# Altium schematic sheet DEVICE-DESKTOP-910Q0FJ.SchDoc
size A4
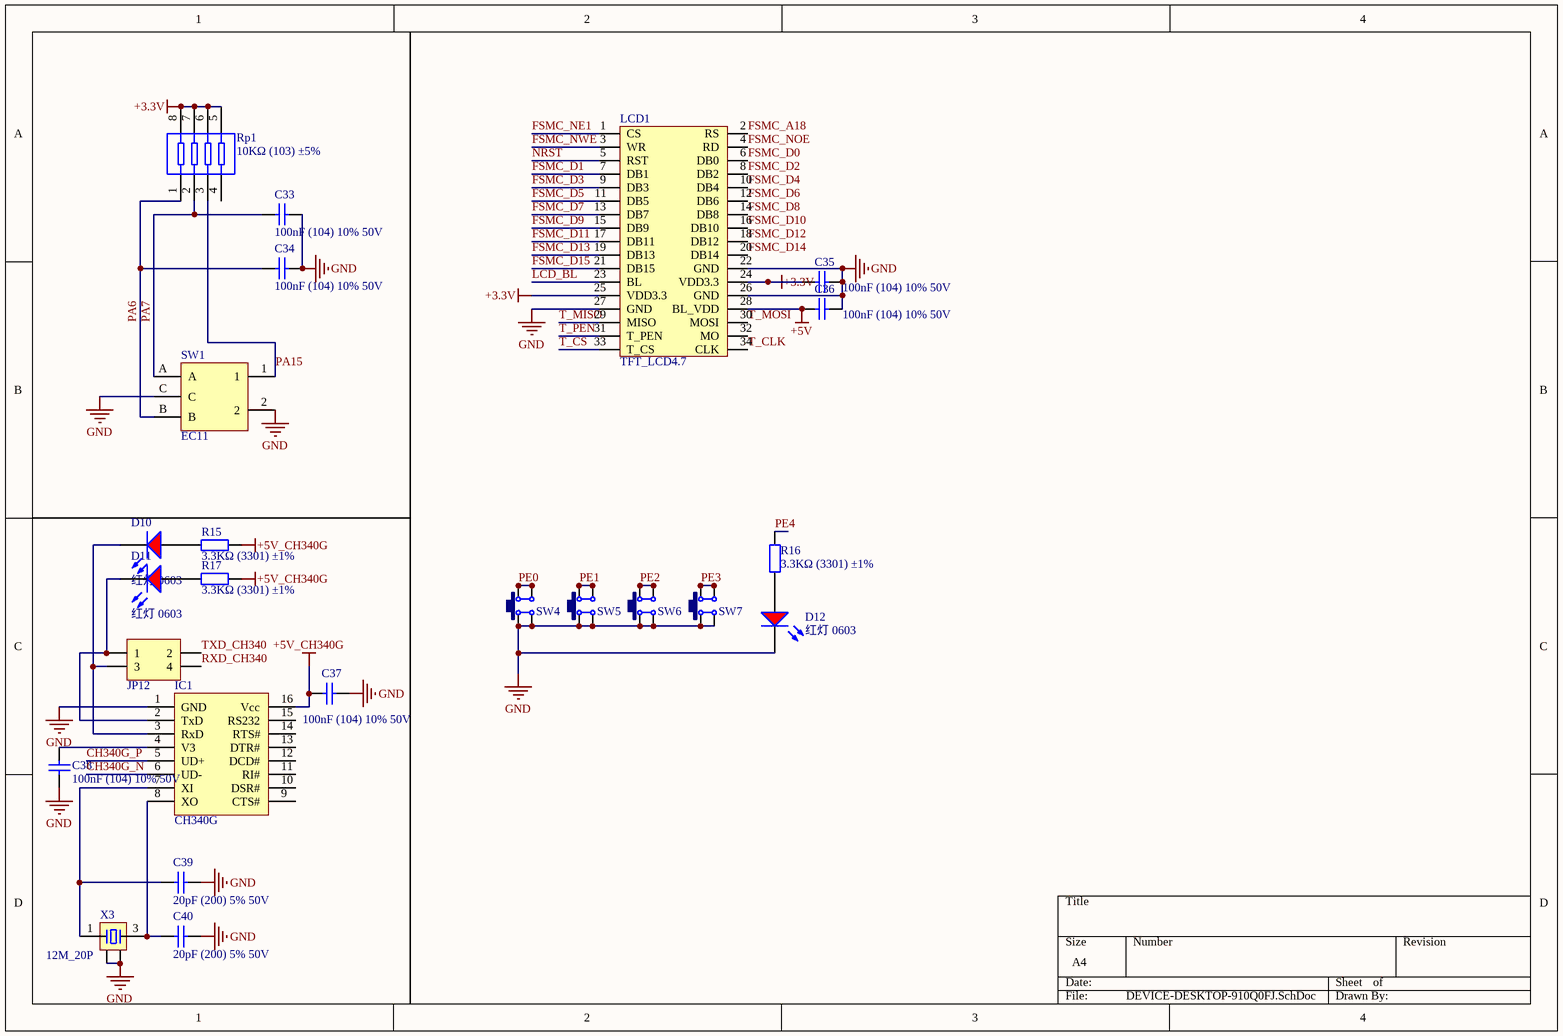
[diagram p0: DEVICE-DESKTOP-910Q0FJ.SchDoc]

## Parts
C33  100nF (104) 10% 50V  [0603_C]
C34  100nF (104) 10% 50V  [0603_C]
C35  100nF (104) 10% 50V  [0603_C]
C36  100nF (104) 10% 50V  [0603_C]
C37  100nF (104) 10% 50V  [0603_C]
C38  100nF (104) 10% 50V  [0603_C]
C39  20pF (200) 5% 50V  [0603_C]
C40  20pF (200) 5% 50V  [0603_C]
D10  红灯 0603  [0603_LED_S1]
D11  红灯 0603  [0603_LED_S1]
D12  红灯 0603  [0603_LED_S1]
IC1  CH340G  [SOP16_L]
JP12  Header2X2  [HDR2.54-LI-2x2P]  (value not drawn)
LCD1  TFT_LCD4.7  [DB2*17-3.5]
R15  3.3KΩ (3301) ±1%  [0603_R]
R16  3.3KΩ (3301) ±1%  [0603_R]
R17  3.3KΩ (3301) ±1%  [0603_R]
Rp1  10KΩ (103) ±5%  [0603_Rx4]
SW1  EC11  [EC11-B]
SW4  6x6x5  [TSW DIP-6*6*6]  (value not drawn)
SW5  6x6x5  [TSW DIP-6*6*6]  (value not drawn)
SW6  6x6x5  [TSW DIP-6*6*6]  (value not drawn)
SW7  6x6x5  [TSW DIP-6*6*6]  (value not drawn)
X3  12M_20P  [OSC 3225-4P]

## Nets
+3.3V: C35.1 LCD1.24(VDD3.3) LCD1.25(VDD3.3) Rp1.5 Rp1.6 Rp1.7 Rp1.8
+5V: C36.2 LCD1.28(BL_VDD)
+5V_CH340G: C37.1 IC1.16(Vcc) R15.2 R17.2
GND: C33.1 C34.1 C35.2 C36.1 C37.2 C38.2 C39.1 C40.1 D12.K IC1.1(GND) LCD1.22(GND) LCD1.26(GND) LCD1.27(GND) SW1.2 SW1.C SW4.1 SW4.4 SW5.1 SW5.4 SW6.1 SW6.4 SW7.1 SW7.4 X3.2 X3.4
CH340G_N: IC1.6(UD-)
CH340G_P: IC1.5(UD+)
FSMC_A18: LCD1.2(RS)
FSMC_D0: LCD1.6(DB0)
FSMC_D1: LCD1.7(DB1)
FSMC_D2: LCD1.8(DB2)
FSMC_D3: LCD1.9(DB3)
FSMC_D4: LCD1.10(DB4)
FSMC_D5: LCD1.11(DB5)
FSMC_D6: LCD1.12(DB6)
FSMC_D7: LCD1.13(DB7)
FSMC_D8: LCD1.14(DB8)
FSMC_D9: LCD1.15(DB9)
FSMC_D10: LCD1.16(DB10)
FSMC_D11: LCD1.17(DB11)
FSMC_D12: LCD1.18(DB12)
FSMC_D13: LCD1.19(DB13)
FSMC_D14: LCD1.20(DB14)
FSMC_D15: LCD1.21(DB15)
FSMC_NE1: LCD1.1(CS)
FSMC_NOE: LCD1.4(RD)
FSMC_NWE: LCD1.3(WR)
LCD_BL: LCD1.23(BL)
NRST: LCD1.5(RST)
PA6: C34.2 Rp1.1 SW1.B
PA7: C33.2 Rp1.2 SW1.A
PA15: Rp1.3 SW1.1
PE0: SW4.2 SW4.3
PE1: SW5.2 SW5.3
PE2: SW6.2 SW6.3
PE3: SW7.2 SW7.3
PE4: R16.2
RXD_CH340: JP12.4
T_CLK: LCD1.34(CLK)
T_CS: LCD1.33(T_CS)
T_MISO: LCD1.29(MISO)
T_MOSI: LCD1.30(MOSI)
T_PEN: LCD1.31(T_PEN)
TXD_CH340: JP12.2
NetC38_1: C38.1 IC1.4(V3)
NetC39_2: C39.2 IC1.7(XI) X3.1
NetC40_2: C40.2 IC1.8(XO) X3.3
NetD10_A: D10.A R15.1
NetD10_K: D10.K IC1.3(RxD) JP12.3
NetD11_A: D11.A R17.1
NetD11_K: D11.K IC1.2(TxD) JP12.1
NetD12_A: D12.A R16.1

Not connected (* = marked no-connect by the designer): IC1 9(CTS#) 10(DSR#) 11(RI#) 12(DCD#) 13(DTR#) 14(RTS#) 15(RS232); LCD1 32(MO); Rp1 4

## Library data of the parts
C33-C38 = 0603 100nF (104) 10% 50V: 贴片电容; ComponentLink1Description: 供应商链接; ComponentLink1URL: http://www.szlcsc.com/product/details_15331.html; Package: 0603; Supplier: LC; SuppliersPartNumber: C14663
C39 C40 = 0603 20pF (200) 5% 50V: 贴片电容; ComponentLink1Description: 供应商链接; ComponentLink1URL: http://www.szlcsc.com/product/details_2000.html; Package: 0603; Supplier: LC; SuppliersPartNumber: C1648
D10-D12 = 0603 红灯: 发光二极管; ComponentLink1Description: 供应商链接; ComponentLink1URL: http://www.szlcsc.com/product/details_2659.html; Package: 0603; Supplier: LC; SuppliersPartNumber: C2286
IC1 = CH340G: 串口转USB; 版权归属: 源创客; BOM名称: 串口转USB; 学习资源: www.ooocke.com
JP12 = Header 2X2: 2*2P接插件; 版权归属: 源创客; BOM名称: 2*2P接插件; 学习资源: www.ooocke.com
R15-R17 = 0603 3.3KΩ (3301) 1%: 贴片电阻; ComponentLink1Description: 供应商链接; ComponentLink1URL: http://www.szlcsc.com/product/details_23705.html; Package: 0603; Supplier: LC; SuppliersPartNumber: C22978
Rp1 = 0603*4  10KΩ (103) 5%: 贴片排阻; ComponentLink1Description: 供应商链接; ComponentLink1URL: http://www.szlcsc.com/product/details_30472.html; Package: 0603*4; Supplier: LC; SuppliersPartNumber: C29718
SW1 = EC11: 数字开关编码器; BOM名称: 数字编码开关; 版权归属: 源创客; 学习资源: www.ooocke.com
SW4-SW7 = TSW DIP-6x6: 直插6x6轻触开关; 版权归属: 源创客; BOM名称: 直插6x6轻触开关; 学习资源: www.ooocke.com
X3 = XTAL-4P: 4脚无源晶振; 版权归属: 源创客; BOM名称: 4脚无源晶振; 学习资源: www.ooocke.com